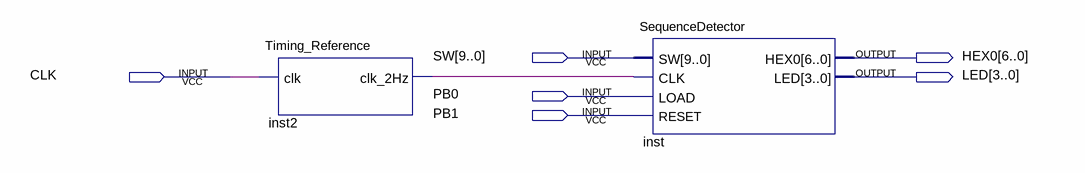
[diagram p0: schematic sheet]
// Quartus schematic Lab6.bdf as structural Verilog: 2 symbols, 6 pins
module Lab6 (
  input  [9:0] SW,
  input  CLK,
  input  PB0,
  input  PB1,
  output [6:0] HEX0,
  output [3:0] LED
);

  wire inst2_clk_2hz;

  Timing_Reference inst2 (.clk(CLK), .clk_2Hz(inst2_clk_2hz));
  SequenceDetector inst (.SW(SW), .CLK(inst2_clk_2hz), .LOAD(PB0), .RESET(PB1), .HEX0(HEX0), .LED(LED));
endmodule
